# Altium schematic sheet 单片机主板.SchDoc
size A3
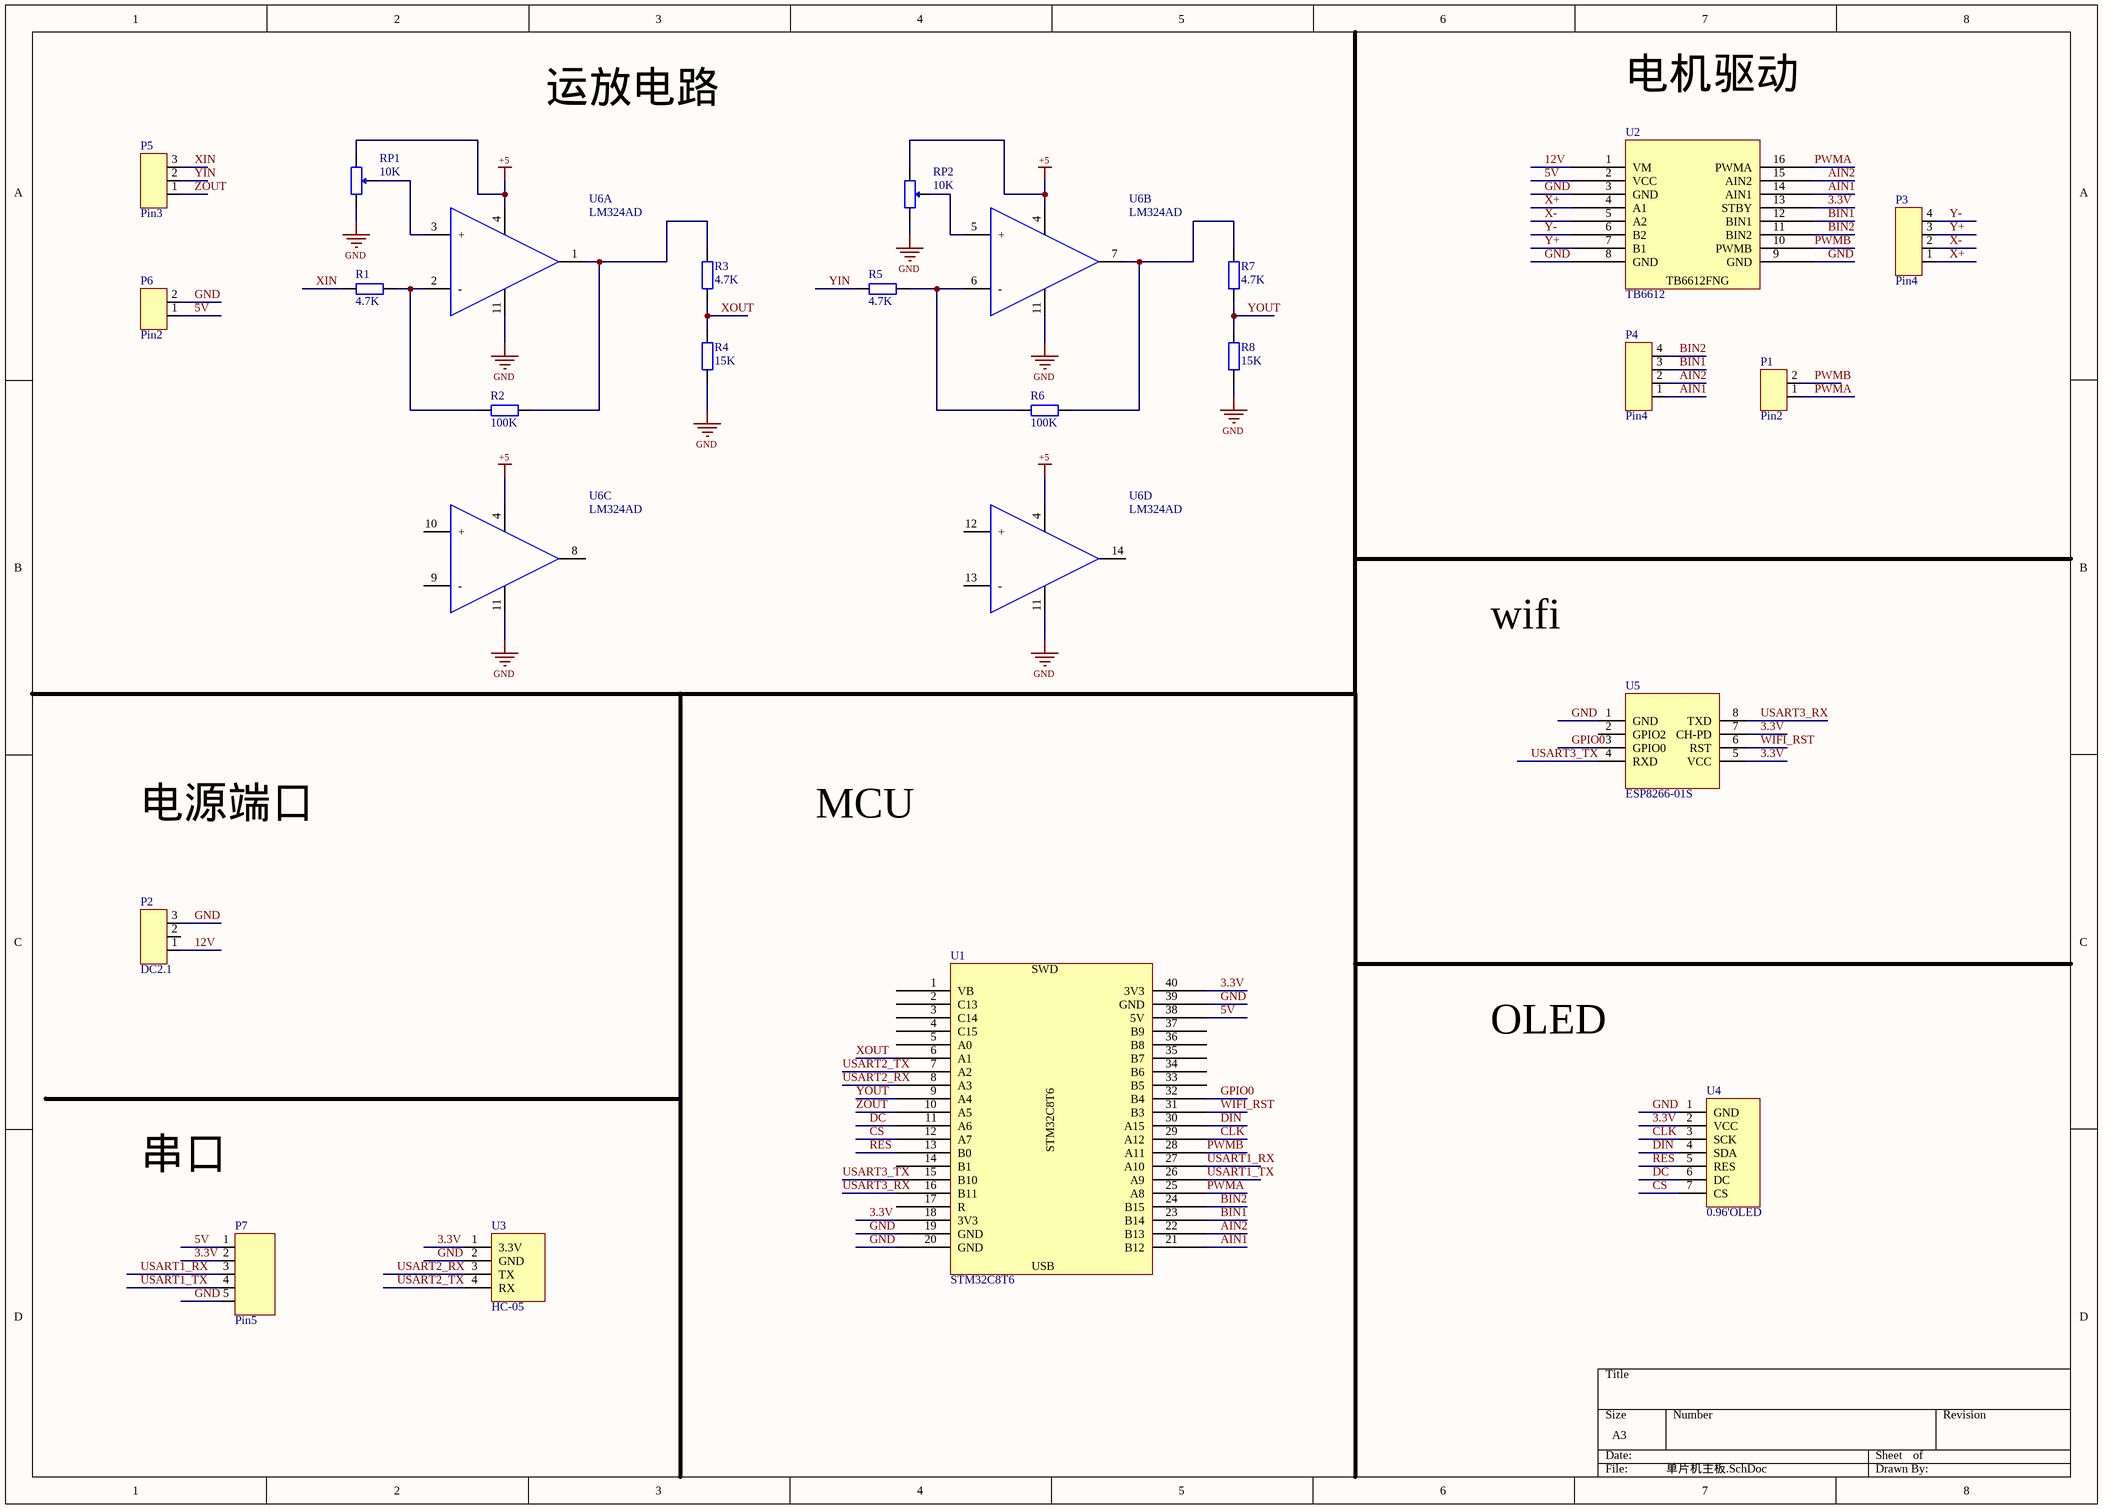
[diagram p0: 单片机主板.SchDoc]

## Parts
P1  Pin2  [HDR2.54-LI-2P]
P2  DC2.1  [DC21]
P3  Pin4  [HDR2.54-LI-4P]
P4  Pin4  [HDR2.54-LI-4P]
P5  Pin3  [HDR2.54-LI-3P]
P6  Pin2  [HDR2.54-LI-2P]
P7  Pin5  [HDR2.54-LI-5P]
R1  4.7K  [RS 1/4W]
R2  100K  [RS 1/4W]
R3  4.7K  [RS 1/4W]
R4  15K  [RS 1/4W]
R5  4.7K  [RS 1/4W]
R6  100K  [RS 1/4W]
R7  4.7K  [RS 1/4W]
R8  15K  [RS 1/4W]
RP1  10K  [3296W]
RP2  10K  [3296W]
U1  STM32C8T6  [STM32C8T6最小系统板]
U2  TB6612  [TB6612]
U3  HC-05  [HC-05]
U4  0.96'OLED  [0.96'OLED]
U5  ESP8266-01S  [ESP8266-01S]
U6  LM324AD  [LM324N]  (parts A,B,C,D of 4)

## Nets
+5: RP1.1 RP2.1 U6.4(VCC)
GND: P2.3 P6.2 P7.5 R4.1 R8.1 RP1.3 RP2.3 U1.19(GND) U1.20(GND) U1.39(GND) U2.3(GND) U2.8(GND) U2.9(GND) U3.2(GND) U4.1(GND) U5.1(GND) U6.11(GND)
3.3V: P7.2 U1.18(3V3) U1.40(3V3) U2.13(STBY) U3.1(3.3V) U4.2(VCC) U5.5(VCC) U5.7(CH-PD)
5V: P6.1 P7.1 U1.38(5V) U2.2(VCC)
12V: P2.1 U2.1(VM)
AIN1: P4.1 U1.21(B12) U2.14(AIN1)
AIN2: P4.2 U1.22(B13) U2.15(AIN2)
BIN1: P4.3 U1.23(B14) U2.12(BIN1)
BIN2: P4.4 U1.24(B15) U2.11(BIN2)
CLK: U1.29(A12) U4.3(SCK)
CS: U1.12(A7) U4.7(CS)
DC: U1.11(A6) U4.6(DC)
DIN: U1.30(A15) U4.4(SDA)
GPIO0: U1.32(B4) U5.3(GPIO0)
PWMA: P1.1 U1.25(A8) U2.16(PWMA)
PWMB: P1.2 U1.28(A11) U2.10(PWMB)
RES: U1.13(B0) U4.5(RES)
USART1_RX: P7.3 U1.27(A10)
USART1_TX: P7.4 U1.26(A9)
USART2_RX: U1.8(A3) U3.3(TX)
USART2_TX: U1.7(A2) U3.4(RX)
USART3_RX: U1.16(B11) U5.8(TXD)
USART3_TX: U1.15(B10) U5.4(RXD)
WIFI_RST: U1.31(B3) U5.6(RST)
X+: P3.1 U2.4(A1)
X-: P3.2 U2.5(A2)
XIN: P5.3 R1.1
XOUT: R3.1 R4.2 U1.6(A1)
Y+: P3.3 U2.7(B1)
Y-: P3.4 U2.6(B2)
YIN: P5.2 R5.1
YOUT: R7.1 R8.2 U1.9(A4)
ZOUT: P5.1 U1.10(A5)
NetR1_2: R1.2 R2.1 U6.2(-)
NetR2_2: R2.2 R3.2 U6.1
NetR5_2: R5.2 R6.1 U6.6(-)
NetR6_2: R6.2 R7.2 U6.7
NetRP1_2: RP1.2 U6.3(+)
NetRP2_2: RP2.2 U6.5(+)

Not connected (* = marked no-connect by the designer): P2 2; U1 1(VB) 2(C13) 3(C14) 4(C15) 5(A0) 14(B1) 17(R) 33(B5) 34(B6) 35(B7) 36(B8) 37(B9); U5 2(GPIO2); U6 8 9(-) 10(+) 12(+) 13(-) 14

## Notes on the sheet
- 运放电路
- 电机驱动
- wifi
- 电源端口
- MCU
- OLED
- 串口
- (in symbol STM32C8T6) SWD; USB
- (in symbol TB6612) TB6612FNG

## Library data of the parts
P1 P6 = Pin2: 两脚2.54mm排针
P2 P5 = Pin3: 三脚2.54mm排针
P3 P4 = Pin4: 四脚2.54mm排针
P7 = Pin5: 五脚2.54mm排针
R1-R8 = R-CRR: 直插色环电阻; BOM名称: 色环电阻; 版权归属: 源创客; 学习资源: www.ooocke.com
RP1 RP2 = RP-ID: 插件单联电位器; BOM名称: 插件电位器; 版权归属: 源创客; 学习资源: www.ooocke.com
U3 = HC-05: 蓝牙模块
U4 = 0.96'OLED: OLED显示屏
U5 = ESP8266-01S: WIFI模块